# Altium project NFC-Reader.PrjPcb (part 6 of 11)
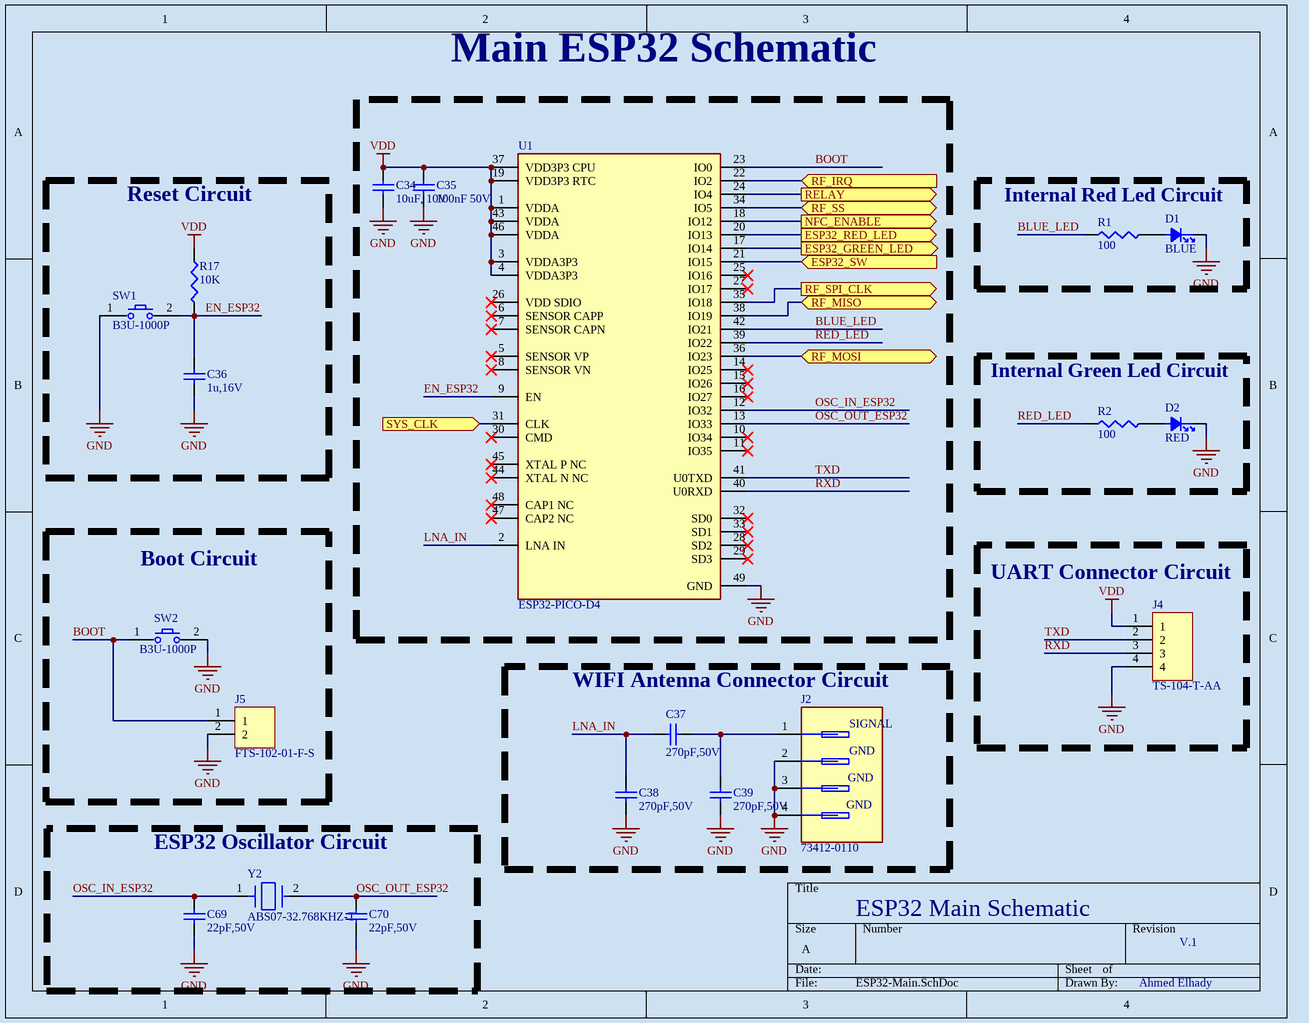
[diagram p9: ESP32-Main.SchDoc]

## Sheet ESP32-Main.SchDoc (continued)
### Library data of the parts
C34 = CL05A106MP8NUB8: 10 µF ±20% 10V Ceramic Capacitor X5R 0402 (1005 Metric); Manufacturer: Samsung Electro-Mechanics; Value: 10µF; Supplier: DigiKey; Manufacturer Part Number: CL05A106MP8NUB8; RoHS: Compliant; Category: Ceramic Capacitors; Pricing: 1=0.13, 10=0.077, 50=0.0678 (USD); Case/Package: 0402; Case Code (Imperial): 0402; Case Code (Metric): 1005; China RoHS: Compliant; Dielectric Material: Ceramic; Height: 800µm; Length: 1mm; Lifecycle Status: Production; Material: Ceramic; Max Operating Temperature: 85°C; Min Operating Temperature: -55°C; Mounting Technology: Surface Mount; Number of Terminals: 2; REACH SVHC: Yes; Schedule B: 8532240020, 8532240020|8532240020, 8532240020|8532240020|8532240020, 8532240020|8532240020|8532240020|8532240020; Thickness: 889µm; Tolerance: 20%; Voltage Rating: 10V; Voltage Rating (DC): 10V; Width: 500µm; ComponentLink1URL: https://datasheet.octopart.com:443/CL05A106MP8NUB8-Samsung-Electro-Mechanics-datasheet-136460857.pdf?src-supplier=IHS; ComponentLink1Description: https://datasheet.octopart.com:443/CL05A106MP8NUB8-Samsung-Electro-Mechanics-datasheet-136460857.pdf?src-supplier=IHS; ComponentLink2URL: https://datasheet.octopart.com:443/CL05A106MP8NUB8-Samsung-Electro-Mechanics-datasheet-181551178.pdf?src-supplier=Newark; ComponentLink2Description: https://datasheet.octopart.com:443/CL05A106MP8NUB8-Samsung-Electro-Mechanics-datasheet-181551178.pdf?src-supplier=Newark; ComponentLink3URL: https://datasheet.octopart.com:443/CL05A106MP8NUB8-Samsung-Electro-Mechanics-datasheet-136031724.pdf?src-supplier=Newark; ComponentLink3Description: https://datasheet.octopart.com:443/CL05A106MP8NUB8-Samsung-Electro-Mechanics-datasheet-136031724.pdf?src-supplier=Newark; ComponentLink4URL: https://datasheet.octopart.com:443/CL05A106MP8NUB8-Samsung-Electro-Mechanics-datasheet-141346815.pdf?src-supplier=Samsung+SCT; ComponentLink4Description: https://datasheet.octopart.com:443/CL05A106MP8NUB8-Samsung-Electro-Mechanics-datasheet-141346815.pdf?src-supplier=Samsung+SCT; ComponentLink5URL: https://datasheet.octopart.com:443/CL05A106MP8NUB8-Samsung-Electro-Mechanics-datasheet-110326781.pdf?src-supplier=Future+Electronics; ComponentLink5Description: https://datasheet.octopart.com:443/CL05A106MP8NUB8-Samsung-Electro-Mechanics-datasheet-110326781.pdf?src-supplier=Future+Electronics; ComponentLink6URL: https://datasheet.octopart.com:443/CL05A106MP8NUB8-Samsung-Electro-Mechanics-datasheet-96443587.pdf?src-supplier=Future+Electronics; ComponentLink6Description: https://datasheet.octopart.com:443/CL05A106MP8NUB8-Samsung-Electro-Mechanics-datasheet-96443587.pdf?src-supplier=Future+Electronics; ComponentLink7URL: https://datasheet.octopart.com:443/CL05A106MP8NUB8-Samsung-Electro-Mechanics-datasheet-68297032.pdf?src-supplier=Future+Electronics; ComponentLink7Description: https://datasheet.octopart.com:443/CL05A106MP8NUB8-Samsung-Electro-Mechanics-datasheet-68297032.pdf?src-supplier=Future+Electronics; ComponentLink8URL: https://datasheet.octopart.com:443/CL05A106MP8NUB8-Samsung-Electro-Mechanics-datasheet-86032222.pdf?src-supplier=Future+Electronics; ComponentLink8Description: https://datasheet.octopart.com:443/CL05A106MP8NUB8-Samsung-Electro-Mechanics-datasheet-86032222.pdf?src-supplier=Future+Electronics; LCSC Part Number: C307415
C35 = CGA3E2X7R1H104K080AA: 0.1 µF ±10% 50V Ceramic Capacitor X7R 0603 (1608 Metric); Manufacturer: TDK; Manufacturer Lifecycle Status: PRODUCTION; Supplier: DigiKey; Manufacturer Part Number: CGA3E2X7R1H104K080AA; RoHS: Compliant; Category: Ceramic Capacitors; Stock: 973492; Pricing: 1=0.1, 10=0.044, 50=0.0302, 100=0.026, 500=0.01886, 1000=0.01666 (USD); Value: 100nF; Case/Package: 0603; Case Code (Imperial): 0603; Case Code (Metric): 1608; China RoHS: Compliant; Composition: Ceramic; Depth: 800µm; Dielectric: X7R; Dielectric Material: Ceramic; Height: 800µm; Lead Free: Lead Free; Length: 1.6mm; Lifecycle Status: Production; Material: Ceramic; Max Length: 1.7mm; Max Operating Temperature: 125°C; Max Width: 900µm; Min Length: 1.5mm; Min Operating Temperature: -55°C; Min Width: 700µm; Mounting Technology: Surface Mount; Number of Terminals: 2; Radiation Hardening: No; Ratings: AEC-Q200; REACH SVHC: Yes; Schedule B: 8532240020, 8532240020|8532240020|8532240020|8532240020|8532240020; Termination: SMD/SMT; Thickness: 889µm; Tolerance: 10%; Voltage: 50V; Voltage Rating: 50V; Voltage Rating (DC): 50V; Weight: 2.012816mg; Width: 800µm; ComponentLink1URL: https://datasheet.octopart.com:443/CGA3E2X7R1H104K080AA-TDK-datasheet-165583812.pdf?src-supplier=IHS; ComponentLink1Description: https://datasheet.octopart.com:443/CGA3E2X7R1H104K080AA-TDK-datasheet-165583812.pdf?src-supplier=IHS; ComponentLink2URL: https://datasheet.octopart.com:443/CGA3E2X7R1H104K080AA-TDK-datasheet-138890726.pdf?src-supplier=Upverter; ComponentLink2Description: https://datasheet.octopart.com:443/CGA3E2X7R1H104K080AA-TDK-datasheet-138890726.pdf?src-supplier=Upverter; ComponentLink3URL: https://datasheet.octopart.com:443/CGA3E2X7R1H104K080AA-TDK-datasheet-43457115.pdf?src-supplier=Upverter; ComponentLink3Description: https://datasheet.octopart.com:443/CGA3E2X7R1H104K080AA-TDK-datasheet-43457115.pdf?src-supplier=Upverter; ComponentLink4URL: https://datasheet.octopart.com:443/CGA3E2X7R1H104K080AA-TDK-datasheet-151546526.pdf?src-supplier=ODG+(Origin+Data+Global); ComponentLink4Description: https://datasheet.octopart.com:443/CGA3E2X7R1H104K080AA-TDK-datasheet-151546526.pdf?src-supplier=ODG+(Origin+Data+Global); ComponentLink5URL: https://datasheet.octopart.com:443/CGA3E2X7R1H104K080AA-TDK-datasheet-43366117.pdf?src-supplier=Newark; ComponentLink5Description: https://datasheet.octopart.com:443/CGA3E2X7R1H104K080AA-TDK-datasheet-43366117.pdf?src-supplier=Newark; ComponentLink6URL: https://datasheet.octopart.com:443/CGA3E2X7R1H104K080AA-TDK-datasheet-23766614.pdf?src-supplier=Newark; ComponentLink6Description: https://datasheet.octopart.com:443/CGA3E2X7R1H104K080AA-TDK-datasheet-23766614.pdf?src-supplier=Newark; ComponentLink7URL: https://datasheet.octopart.com:443/CGA3E2X7R1H104K080AA-TDK-datasheet-13444418.pdf?src-supplier=Newark; ComponentLink7Description: https://datasheet.octopart.com:443/CGA3E2X7R1H104K080AA-TDK-datasheet-13444418.pdf?src-supplier=Newark; ComponentLink8URL: https://datasheet.octopart.com:443/CGA3E2X7R1H104K080AA.-TDK-datasheet-159510193.pdf?src-supplier=Newark; ComponentLink8Description: https://datasheet.octopart.com:443/CGA3E2X7R1H104K080AA.-TDK-datasheet-159510193.pdf?src-supplier=Newark; ComponentLink9URL: https://datasheet.octopart.com:443/CGA3E2X7R1H104K080AA-TDK-datasheet-136412745.pdf?src-supplier=element14+APAC; ComponentLink9Description: https://datasheet.octopart.com:443/CGA3E2X7R1H104K080AA-TDK-datasheet-136412745.pdf?src-supplier=element14+APAC; ComponentLink10URL: https://datasheet.octopart.com:443/CGA3E2X7R1H104K080AA-TDK-datasheet-21217900.pdf?src-supplier=Farnell; ComponentLink10Description: https://datasheet.octopart.com:443/CGA3E2X7R1H104K080AA-TDK-datasheet-21217900.pdf?src-supplier=Farnell; ComponentLink11URL: https://datasheet.octopart.com:443/CGA3E2X7R1H104K080AA-TDK-datasheet-164882302.pdf?src-supplier=Burklin+Elektronik; ComponentLink11Description: https://datasheet.octopart.com:443/CGA3E2X7R1H104K080AA-TDK-datasheet-164882302.pdf?src-supplier=Burklin+Elektronik; ComponentLink12URL: https://datasheet.octopart.com:443/CGA3E2X7R1H104K080AA-TDK-datasheet-13234200.pdf?src-supplier=Future+Electronics; ComponentLink12Description: https://datasheet.octopart.com:443/CGA3E2X7R1H104K080AA-TDK-datasheet-13234200.pdf?src-supplier=Future+Electronics; ComponentLink13URL: https://datasheet.octopart.com:443/CGA3E2X7R1H104K080AA-TDK-datasheet-12527010.pdf?src-supplier=Future+Electronics; ComponentLink13Description: https://datasheet.octopart.com:443/CGA3E2X7R1H104K080AA-TDK-datasheet-12527010.pdf?src-supplier=Future+Electronics; ComponentLink14URL: https://datasheet.octopart.com:443/CGA3E2X7R1H104K080AA-TDK-datasheet-140571036.pdf?src-supplier=Arrow.cn; ComponentLink14Description: https://datasheet.octopart.com:443/CGA3E2X7R1H104K080AA-TDK-datasheet-140571036.pdf?src-supplier=Arrow.cn; LCSC PN: C189228
C36 = EMK107B7105KA-T: 1 µF ±10% 16V Ceramic Capacitor X7R 0603 (1608 Metric); Manufacturer: Taiyo Yuden; Value: 1µF; Supplier: DigiKey; Manufacturer Part Number: EMK107B7105KA-T; RoHS: Compliant; Category: Ceramic Capacitors; Stock: 1003655; Pricing: 1=0.08, 10=0.013, 50=0.0116, 100=0.0104, 500=0.00964 (USD); Case/Package: 0603; Case Code (Imperial): 0603; Case Code (Metric): 1608; China RoHS: Compliant; Composition: Ceramic; Contact Plating: Nickel; Depth: 800µm; Dielectric: X7R; Dielectric Material: Ceramic; Halogen Free: Halogen Free; Height: 800µm; Lead Free: Lead Free; Length: 1.6mm; Lifecycle Status: Production; Material: Ceramic; Max Length: 1.7mm; Max Operating Temperature: 125°C; Max Thickness: 900µm; Max Width: 900µm; Min Length: 1.5mm; Min Operating Temperature: -55°C; Min Thickness: 700µm; Min Width: 700µm; Mounting Technology: Surface Mount; Pins: 2; Number of Terminals: 2; Packaging: Cut Tape; Radiation Hardening: No; REACH SVHC: Yes; Termination: SMD/SMT; Thickness: 889µm; Tolerance: 10%; Voltage Rating: 16V; Voltage Rating (DC): 16V; Width: 800µm; ComponentLink1URL: https://datasheet.octopart.com:443/EMK107B7105KA-T-Taiyo-Yuden-datasheet-182102775.pdf?src-supplier=IHS; ComponentLink1Description: https://datasheet.octopart.com:443/EMK107B7105KA-T-Taiyo-Yuden-datasheet-182102775.pdf?src-supplier=IHS; ComponentLink2URL: https://datasheet.octopart.com:443/EMK107B7105KA-T-Taiyo-Yuden-datasheet-8857305.pdf?src-supplier=Master+Electronics; ComponentLink2Description: https://datasheet.octopart.com:443/EMK107B7105KA-T-Taiyo-Yuden-datasheet-8857305.pdf?src-supplier=Master+Electronics; ComponentLink3URL: https://datasheet.octopart.com:443/EMK107B7105KA-T-Taiyo-Yuden-datasheet-154807686.pdf?src-supplier=Master+Electronics; ComponentLink3Description: https://datasheet.octopart.com:443/EMK107B7105KA-T-Taiyo-Yuden-datasheet-154807686.pdf?src-supplier=Master+Electronics; ComponentLink4URL: https://datasheet.octopart.com:443/EMK107B7105KA-T-Taiyo-Yuden-datasheet-140424376.pdf?src-supplier=Master+Electronics; ComponentLink4Description: https://datasheet.octopart.com:443/EMK107B7105KA-T-Taiyo-Yuden-datasheet-140424376.pdf?src-supplier=Master+Electronics; ComponentLink5URL: https://datasheet.octopart.com:443/EMK107B7105KA-T-Taiyo-Yuden-datasheet-151625811.pdf?src-supplier=Farnell; ComponentLink5Description: https://datasheet.octopart.com:443/EMK107B7105KA-T-Taiyo-Yuden-datasheet-151625811.pdf?src-supplier=Farnell; ComponentLink6URL: https://datasheet.octopart.com:443/EMK107B7105KA-T-Taiyo-Yuden-datasheet-65850851.pdf?src-supplier=Newark; ComponentLink6Description: https://datasheet.octopart.com:443/EMK107B7105KA-T-Taiyo-Yuden-datasheet-65850851.pdf?src-supplier=Newark; ComponentLink7URL: https://datasheet.octopart.com:443/EMK107B7105KA-T-Taiyo-Yuden-datasheet-14717454.pdf?src-supplier=Newark; ComponentLink7Description: https://datasheet.octopart.com:443/EMK107B7105KA-T-Taiyo-Yuden-datasheet-14717454.pdf?src-supplier=Newark; ComponentLink8URL: https://datasheet.octopart.com:443/EMK107B7105KA-T-Taiyo-Yuden-datasheet-138738940.pdf?src-supplier=Taiyo+Yuden+SCT; ComponentLink8Description: https://datasheet.octopart.com:443/EMK107B7105KA-T-Taiyo-Yuden-datasheet-138738940.pdf?src-supplier=Taiyo+Yuden+SCT; ComponentLink9URL: https://datasheet.octopart.com:443/EMK107B7105KA-T-Taiyo-Yuden-datasheet-99784766.pdf?src-supplier=Future+Electronics; ComponentLink9Description: https://datasheet.octopart.com:443/EMK107B7105KA-T-Taiyo-Yuden-datasheet-99784766.pdf?src-supplier=Future+Electronics; ComponentLink10URL: https://datasheet.octopart.com:443/EMK107B7105KA-T-Taiyo-Yuden-datasheet-99833418.pdf?src-supplier=Future+Electronics; ComponentLink10Description: https://datasheet.octopart.com:443/EMK107B7105KA-T-Taiyo-Yuden-datasheet-99833418.pdf?src-supplier=Future+Electronics; ComponentLink11URL: https://datasheet.octopart.com:443/CEEMK107B7105KA-T-Taiyo-Yuden-datasheet-62282700.pdf?src-supplier=Electro+Sonic; ComponentLink11Description: https://datasheet.octopart.com:443/CEEMK107B7105KA-T-Taiyo-Yuden-datasheet-62282700.pdf?src-supplier=Electro+Sonic; ComponentLink12URL: https://datasheet.octopart.com:443/EMK107B7105KA-T-Taiyo-Yuden-datasheet-62109223.pdf?src-supplier=Electro+Sonic; ComponentLink12Description: https://datasheet.octopart.com:443/EMK107B7105KA-T-Taiyo-Yuden-datasheet-62109223.pdf?src-supplier=Electro+Sonic; ComponentLink13URL: https://datasheet.octopart.com:443/EMK107B7105KA-T-Taiyo-Yuden-datasheet-41181424.pdf?src-supplier=Electro+Sonic; ComponentLink13Description: https://datasheet.octopart.com:443/EMK107B7105KA-T-Taiyo-Yuden-datasheet-41181424.pdf?src-supplier=Electro+Sonic; ComponentLink14URL: https://datasheet.octopart.com/EMK107B7105KA-T-Taiyo-Yuden-datasheet-17272276.pdf; ComponentLink14Description: https://datasheet.octopart.com/EMK107B7105KA-T-Taiyo-Yuden-datasheet-17272276.pdf; ComponentLink15URL: https://datasheet.octopart.com:443/EMK107B7105KA-T-Taiyo-Yuden-datasheet-13693549.pdf?src-supplier=_legacy+Avnet; ComponentLink15Description: https://datasheet.octopart.com:443/EMK107B7105KA-T-Taiyo-Yuden-datasheet-13693549.pdf?src-supplier=_legacy+Avnet; ComponentLink16URL: https://datasheet.octopart.com:443/EMK107B7105KA-T-Taiyo-Yuden-datasheet-10851928.pdf?src-supplier=element14; ComponentLink16Description: https://datasheet.octopart.com:443/EMK107B7105KA-T-Taiyo-Yuden-datasheet-10851928.pdf?src-supplier=element14; ComponentLink17URL: https://datasheet.octopart.com:443/EMK107B7105KA-T-Taiyo-Yuden-datasheet-8434558.pdf?src-supplier=element14; ComponentLink17Description: https://datasheet.octopart.com:443/EMK107B7105KA-T-Taiyo-Yuden-datasheet-8434558.pdf?src-supplier=element14; ComponentLink18URL: https://datasheet.octopart.com:443/EMK107B7105KA-T-Taiyo-Yuden-datasheet-10742123.pdf?src-supplier=Factory+Futures; ComponentLink18Description: https://datasheet.octopart.com:443/EMK107B7105KA-T-Taiyo-Yuden-datasheet-10742123.pdf?src-supplier=Factory+Futures; LCSC PN: C92759
C37-C39 = GCM1555C1H271JA16D: 270 pF ±5% 50V Ceramic Capacitor C0G, NP0 0402 (1005 Metric); Manufacturer: Murata; Manufacturer Lifecycle Status: IN PRODUCTION; Temperature Coefficient: 30ppm/°C; Supplier: DigiKey; Manufacturer Part Number: GCM1555C1H271JA16D; RoHS: Compliant; Category: Ceramic Capacitors; Stock: 38477; Pricing: 1=0.1, 10=0.039, 50=0.0262, 100=0.0224, 500=0.0161, 1000=0.01417, 2500=0.01216, 5000=0.01091, 10000=0.00866, 20000=0.00857, 30000=0.00852, 50000=0.00843, 70000=0.00816, 100000=0.0079, 120000=0.00778, 240000=0.00768 (USD); Value: 270pF; Case/Package: 0402; Case Code (Imperial): 0402; Case Code (Metric): 1005; Depth: 500µm; Dielectric: C0G; Dielectric Material: Ceramic; Height: 500µm; Length: 1mm; Lifecycle Status: Production; Material: Ceramic; Max Operating Temperature: 125°C; Min Operating Temperature: -55°C; Mounting Technology: Surface Mount; Number of Terminals: 2; Packaging: Tape & Reel; Radiation Hardening: No; Ratings: AEC-Q200; REACH SVHC: Yes; Schedule B: 8532240020, 8532240020|8532240020, 8532240020|8532240020|8532240020, 8532240020|8532240020|8532240020|8532240020; Termination: SMD/SMT; Tolerance: 5%; Voltage Rating: 50V; Voltage Rating (DC): 50V; Width: 500µm; ComponentLink1URL: https://datasheet.octopart.com:443/GCM1555C1H271JA16D-Murata-datasheet-149522333.pdf?src-supplier=Newark; ComponentLink1Description: https://datasheet.octopart.com:443/GCM1555C1H271JA16D-Murata-datasheet-149522333.pdf?src-supplier=Newark; ComponentLink2URL: https://datasheet.octopart.com:443/GCM1555C1H271JA16D-Murata-datasheet-141265891.pdf?src-supplier=Geoflip; ComponentLink2Description: https://datasheet.octopart.com:443/GCM1555C1H271JA16D-Murata-datasheet-141265891.pdf?src-supplier=Geoflip; ComponentLink3URL: https://datasheet.octopart.com:443/GCM1555C1H271JA16D-Murata-datasheet-178527090.pdf?src-supplier=Arrow.cn; ComponentLink3Description: https://datasheet.octopart.com:443/GCM1555C1H271JA16D-Murata-datasheet-178527090.pdf?src-supplier=Arrow.cn; ComponentLink4URL: https://datasheet.octopart.com:443/GCM1555C1H271JA16D-Murata-datasheet-140656005.pdf?src-supplier=Ciiva; ComponentLink4Description: https://datasheet.octopart.com:443/GCM1555C1H271JA16D-Murata-datasheet-140656005.pdf?src-supplier=Ciiva; ComponentLink5URL: https://datasheet.octopart.com:443/GCM1555C1H271JA16D-Murata-datasheet-138715700.pdf?src-supplier=Ciiva; ComponentLink5Description: https://datasheet.octopart.com:443/GCM1555C1H271JA16D-Murata-datasheet-138715700.pdf?src-supplier=Ciiva; ComponentLink6URL: https://datasheet.octopart.com:443/GCM1555C1H271JA16D-Murata-datasheet-128592787.pdf?src-supplier=X-ON; ComponentLink6Description: https://datasheet.octopart.com:443/GCM1555C1H271JA16D-Murata-datasheet-128592787.pdf?src-supplier=X-ON; ComponentLink7URL: https://datasheet.octopart.com:443/GCM1555C1H271JA16D-Murata-datasheet-11767037.pdf?src-supplier=Arrow+Electronics; ComponentLink7Description: https://datasheet.octopart.com:443/GCM1555C1H271JA16D-Murata-datasheet-11767037.pdf?src-supplier=Arrow+Electronics; ComponentLink8URL: https://datasheet.octopart.com:443/GCM1555C1H271JA16D-Murata-datasheet-12511495.pdf?src-supplier=TME; ComponentLink8Description: https://datasheet.octopart.com:443/GCM1555C1H271JA16D-Murata-datasheet-12511495.pdf?src-supplier=TME; ComponentLink9URL: https://datasheet.octopart.com/GCM1555C1H271JA16D-Murata-datasheet-14404338.pdf; ComponentLink9Description: https://datasheet.octopart.com/GCM1555C1H271JA16D-Murata-datasheet-14404338.pdf; ComponentLink10URL: http://sigma.octopart.com:80/reach_statement/Murata-company-16.pdf?src-supplier=Compliance+Statements; ComponentLink10Description: http://sigma.octopart.com:80/reach_statement/Murata-company-16.pdf?src-supplier=Compliance+Statements; LCSC PN: C524551
C69 C70 = C0603C220J5GACTU: 22 pF ±5% 50V Ceramic Capacitor C0G, NP0 0603 (1608 Metric); Manufacturer: KEMET; Temperature Coefficient: 30ppm/°C; Supplier: DigiKey; Manufacturer Part Number: C0603C220J5GACTU; RoHS: Compliant; Category: Ceramic Capacitors; Stock: 154784; Pricing: 1=0.12, 10=0.069, 50=0.0476, 100=0.0413, 500=0.03068, 1000=0.0274, 4000=0.02251, 8000=0.01825, 12000=0.01762, 20000=0.0175, 28000=0.01691, 40000=0.01684, 48000=0.0168, 96000=0.01646, 100000=0.01642 (USD); Value: 22pF; Case/Package: 0603; Case Code (Imperial): 0603; China RoHS: Compliant; Contact Material: Tin; Depth: 800µm; Dielectric: C0G; Dielectric Material: Ceramic; Height: 800µm; Lead Free: Lead Free; Length: 1.6mm; Lifecycle Status: Production; Material: Ceramic; Max Operating Temperature: 125°C; Min Operating Temperature: -55°C; Mounting Technology: Surface Mount; Pins: 2; Number of Terminals: 2; Radiation Hardening: No; REACH SVHC: Yes; Schedule B: 8532240020, 8532240020|8532240020, 8532240020|8532240020|8532240020, 8532240020|8532240020|8532240020|8532240020; Termination: SMD/SMT; Thickness: 863.6µm; Tolerance: 5%; Voltage: 50V; Voltage Rating: 50V; Voltage Rating (DC): 50V; Weight: 2.012816mg; Width: 800µm; ComponentLink1URL: https://datasheet.octopart.com:443/C0603C220J5GACTU-KEMET-datasheet-178132257.pdf?src-supplier=IHS; ComponentLink1Description: https://datasheet.octopart.com:443/C0603C220J5GACTU-KEMET-datasheet-178132257.pdf?src-supplier=IHS; ComponentLink2URL: https://datasheet.octopart.com:443/C0603C220J5GAC7867-KEMET-datasheet-184792853.pdf?src-supplier=IHS; ComponentLink2Description: https://datasheet.octopart.com:443/C0603C220J5GAC7867-KEMET-datasheet-184792853.pdf?src-supplier=IHS; ComponentLink3URL: https://datasheet.octopart.com:443/C0603C220J5GACTU-KEMET-datasheet-68331921.pdf?src-supplier=Upverter; ComponentLink3Description: https://datasheet.octopart.com:443/C0603C220J5GACTU-KEMET-datasheet-68331921.pdf?src-supplier=Upverter; ComponentLink4URL: https://datasheet.octopart.com:443/C0603C220J5GACTU-KEMET-datasheet-137357764.pdf?src-supplier=Upverter; ComponentLink4Description: https://datasheet.octopart.com:443/C0603C220J5GACTU-KEMET-datasheet-137357764.pdf?src-supplier=Upverter; ComponentLink5URL: https://datasheet.octopart.com:443/C0603C220J5GACTU-Kemet-datasheet-5314449.pdf?src-supplier=Newark; ComponentLink5Description: https://datasheet.octopart.com:443/C0603C220J5GACTU-Kemet-datasheet-5314449.pdf?src-supplier=Newark; ComponentLink6URL: https://datasheet.octopart.com:443/C0603C220J5GACTU-Kemet-datasheet-10282724.pdf?src-supplier=Newark; ComponentLink6Description: https://datasheet.octopart.com:443/C0603C220J5GACTU-Kemet-datasheet-10282724.pdf?src-supplier=Newark; ComponentLink7URL: https://datasheet.octopart.com:443/C0603C220J5GACTU-KEMET-datasheet-176142189.pdf?src-supplier=Newark; ComponentLink7Description: https://datasheet.octopart.com:443/C0603C220J5GACTU-KEMET-datasheet-176142189.pdf?src-supplier=Newark; ComponentLink8URL: https://datasheet.octopart.com:443/C0603C220J5GACTU-KEMET-datasheet-149521956.pdf?src-supplier=Farnell; ComponentLink8Description: https://datasheet.octopart.com:443/C0603C220J5GACTU-KEMET-datasheet-149521956.pdf?src-supplier=Farnell; ComponentLink9URL: https://datasheet.octopart.com:443/C0603C220J5GACTU-KEMET-datasheet-101575729.pdf?src-supplier=Farnell; ComponentLink9Description: https://datasheet.octopart.com:443/C0603C220J5GACTU-KEMET-datasheet-101575729.pdf?src-supplier=Farnell; ComponentLink10URL: https://datasheet.octopart.com:443/C0603C220J5GACTU-Kemet-datasheet-10540709.pdf?src-supplier=Farnell; ComponentLink10Description: https://datasheet.octopart.com:443/C0603C220J5GACTU-Kemet-datasheet-10540709.pdf?src-supplier=Farnell; ComponentLink11URL: https://datasheet.octopart.com:443/C0603C220J5GACTU-KEMET-datasheet-176142187.pdf?src-supplier=element14+APAC; ComponentLink11Description: https://datasheet.octopart.com:443/C0603C220J5GACTU-KEMET-datasheet-176142187.pdf?src-supplier=element14+APAC; ComponentLink12URL: https://datasheet.octopart.com:443/C0603C220J5GACTU-KEMET-datasheet-176142144.pdf?src-supplier=element14+APAC; ComponentLink12Description: https://datasheet.octopart.com:443/C0603C220J5GACTU-KEMET-datasheet-176142144.pdf?src-supplier=element14+APAC; ComponentLink13URL: https://datasheet.octopart.com:443/C0603C220J5GACTU-Kemet-datasheet-22084244.pdf?src-supplier=element14+APAC; ComponentLink13Description: https://datasheet.octopart.com:443/C0603C220J5GACTU-Kemet-datasheet-22084244.pdf?src-supplier=element14+APAC; ComponentLink14URL: https://datasheet.octopart.com:443/C0603C220J5GACTU-Kemet-datasheet-48952580.pdf?src-supplier=element14+APAC; ComponentLink14Description: https://datasheet.octopart.com:443/C0603C220J5GACTU-Kemet-datasheet-48952580.pdf?src-supplier=element14+APAC; ComponentLink15URL: https://datasheet.octopart.com:443/C0603C220J5GACTU-KEMET-datasheet-157246123.pdf?src-supplier=Electro+Sonic; ComponentLink15Description: https://datasheet.octopart.com:443/C0603C220J5GACTU-KEMET-datasheet-157246123.pdf?src-supplier=Electro+Sonic; ComponentLink16URL: https://datasheet.octopart.com:443/C0603C220J5GACTU-KEMET-datasheet-41232428.pdf?src-supplier=Electro+Sonic; ComponentLink16Description: https://datasheet.octopart.com:443/C0603C220J5GACTU-KEMET-datasheet-41232428.pdf?src-supplier=Electro+Sonic; ComponentLink17URL: https://datasheet.octopart.com:443/C0603C220J5GACTU-KEMET-datasheet-96931677.pdf?src-supplier=TME; ComponentLink17Description: https://datasheet.octopart.com:443/C0603C220J5GACTU-KEMET-datasheet-96931677.pdf?src-supplier=TME; ComponentLink18URL: https://datasheet.octopart.com/C0603C220J5GACTU-KEMET-datasheet-84169754.pdf; ComponentLink18Description: https://datasheet.octopart.com/C0603C220J5GACTU-KEMET-datasheet-84169754.pdf; ComponentLink19URL: https://datasheet.octopart.com:443/C0603C220J5GAC7867-KEMET-datasheet-164857143.pdf?src-supplier=Burklin+Elektronik; ComponentLink19Description: https://datasheet.octopart.com:443/C0603C220J5GAC7867-KEMET-datasheet-164857143.pdf?src-supplier=Burklin+Elektronik; ComponentLink20URL: https://datasheet.octopart.com:443/C0603C220J5GAC-TU-Kemet-datasheet-7278821.pdf?src-supplier=Jameco; ComponentLink20Description: https://datasheet.octopart.com:443/C0603C220J5GAC-TU-Kemet-datasheet-7278821.pdf?src-supplier=Jameco; ComponentLink21URL: https://datasheet.octopart.com:443/C0603C220J5GACTU-Kemet-datasheet-464.pdf?src-supplier=RS+(Formerly+Allied+Electronics); ComponentLink21Description: https://datasheet.octopart.com:443/C0603C220J5GACTU-Kemet-datasheet-464.pdf?src-supplier=RS+(Formerly+Allied+Electronics); LCSC PN: C2167297
D1 = VLMB1500-GS08: Blue 472nm LED Indication - Discrete 2.8V 0402 (1005 Metric); Manufacturer: Vishay; Dominant Wavelength: 470nm; Forward Current: 20mA; Forward Voltage: 3.15V; Lens Color: Clear; Lens Style: Rectangular; Luminous Intensity: 11.2mcd; Max Power Dissipation: 76mW; Number of Circuits: 1; Peak Wavelength: 468nm; Power Rating: 75mW; Reverse Voltage: 5V; Test Current: 5mA; Viewing Angle: 130°; Supplier: DigiKey; Manufacturer Part Number: VLMB1500-GS08; RoHS: Compliant; Category: LEDs; Stock: 220164; Pricing: 1=0.27, 10=0.184, 100=0.1293, 500=0.10424, 1000=0.09596 (USD); Ambient Temperature Range High: 80°C; Case/Package: 0402; Case Code (Imperial): 0402; Case Code (Metric): 1005; Color: Blue; Contact Plating: Tin; Depth: 500µm; Height: 350µm; Illumination Color: Blue; Lead Free: Lead Free; Length: 1mm; Lifecycle Status: Production; Max Operating Temperature: 80°C; Min Operating Temperature: -30°C; Mounting Technology: Surface Mount; Number of Elements: 1; Number of LEDs: 1; Pins: 2; Number of Terminals: 2; Packaging: Cut Tape; Power Dissipation: 76mW; Radiation Hardening: No; REACH SVHC: Yes; Schedule B: 8541402000, 8541402000|8541402000|8541402000|8541402000|8541402000; Shape: Rectangular; Terminal Pitch: 675µm; Wavelength: 472nm; Width: 500µm; ComponentLink1URL: https://datasheet.octopart.com:443/VLMB1500-GS08-Vishay-datasheet-181477802.pdf?src-supplier=IHS; ComponentLink1Description: https://datasheet.octopart.com:443/VLMB1500-GS08-Vishay-datasheet-181477802.pdf?src-supplier=IHS; ComponentLink2URL: https://datasheet.octopart.com:443/VLMB1500-GS08-Vishay-datasheet-21227148.pdf?src-supplier=element14+APAC; ComponentLink2Description: https://datasheet.octopart.com:443/VLMB1500-GS08-Vishay-datasheet-21227148.pdf?src-supplier=element14+APAC; ComponentLink3URL: https://datasheet.octopart.com:443/VLMB1500-GS08-Vishay-datasheet-78835484.pdf?src-supplier=element14+APAC; ComponentLink3Description: https://datasheet.octopart.com:443/VLMB1500-GS08-Vishay-datasheet-78835484.pdf?src-supplier=element14+APAC; ComponentLink4URL: https://datasheet.octopart.com:443/VLMB1500-GS08-Vishay-datasheet-33014519.pdf?src-supplier=element14+APAC; ComponentLink4Description: https://datasheet.octopart.com:443/VLMB1500-GS08-Vishay-datasheet-33014519.pdf?src-supplier=element14+APAC; ComponentLink5URL: https://datasheet.octopart.com:443/VLMB1500-GS08-Vishay-datasheet-102762782.pdf?src-supplier=Upverter; ComponentLink5Description: https://datasheet.octopart.com:443/VLMB1500-GS08-Vishay-datasheet-102762782.pdf?src-supplier=Upverter; ComponentLink6URL: https://datasheet.octopart.com:443/VLMB1500-GS08-Vishay-datasheet-82289476.pdf?src-supplier=TME; ComponentLink6Description: https://datasheet.octopart.com:443/VLMB1500-GS08-Vishay-datasheet-82289476.pdf?src-supplier=TME; ComponentLink7URL: https://datasheet.octopart.com:443/VLMB1500-GS08-Vishay-datasheet-62332426.pdf?src-supplier=Newark; ComponentLink7Description: https://datasheet.octopart.com:443/VLMB1500-GS08-Vishay-datasheet-62332426.pdf?src-supplier=Newark; ComponentLink8URL: http://sigma.octopart.com:80/rohs_statement/Vishay-company-15.pdf?src-supplier=Compliance+Statements; ComponentLink8Description: http://sigma.octopart.com:80/rohs_statement/Vishay-company-15.pdf?src-supplier=Compliance+Statements; LCSC PN: C511042
D2 = VLMS1500-GS08: Red 631nm LED Indication - Discrete 2V 0402 (1005 Metric); Manufacturer: Vishay; Forward Current: 30mA; Forward Voltage: 2.4V; Lens Style: Rectangular, Square; Luminous Intensity: 18mcd; Number of Circuits: 1; Power Rating: 75mW; Reverse Voltage: 5V; Shape: Rectangular; Test Current: 20mA; Viewing Angle: 130°; Supplier: DigiKey; Manufacturer Part Number: VLMS1500-GS08; RoHS: Compliant; Category: LEDs; Pricing: 1=0.24, 10=0.164, 100=0.1147, 500=0.09218, 1000=0.0847 (USD); Case/Package: 0402; Case Code (Imperial): 0402; Case Code (Metric): 1005; Color: Red; Dominant Wavelength: 631nm; Height: 350µm; Illumination Color: Red; Lead Free: Lead Free; Length: 1mm; Lifecycle Status: Production; Max Operating Temperature: 85°C; Min Operating Temperature: -30°C; Mounting Technology: Surface Mount; Number of LEDs: 1; Pins: 2; Number of Terminals: 2; Packaging: Cut Tape; Peak Wavelength: 631nm; Radiation Hardening: No; REACH SVHC: Yes; Schedule B: 8541402000, 8541402000|8541402000|8541402000|8541402000|8541402000; Terminal Pitch: 675µm; Wavelength: 631nm; Width: 500µm; ComponentLink1URL: https://datasheet.octopart.com:443/VLMS1500-GS08-Vishay-datasheet-181477802.pdf?src-supplier=IHS; ComponentLink1Description: https://datasheet.octopart.com:443/VLMS1500-GS08-Vishay-datasheet-181477802.pdf?src-supplier=IHS; ComponentLink2URL: https://datasheet.octopart.com:443/VLMS1500-GS08-Vishay-datasheet-21227148.pdf?src-supplier=Future+Electronics; ComponentLink2Description: https://datasheet.octopart.com:443/VLMS1500-GS08-Vishay-datasheet-21227148.pdf?src-supplier=Future+Electronics; ComponentLink3URL: https://datasheet.octopart.com:443/VLMS1500-GS08-Vishay-datasheet-102762782.pdf?src-supplier=Future+Electronics; ComponentLink3Description: https://datasheet.octopart.com:443/VLMS1500-GS08-Vishay-datasheet-102762782.pdf?src-supplier=Future+Electronics; ComponentLink4URL: https://datasheet.octopart.com:443/VLMS1500-GS08-Vishay-datasheet-33014519.pdf?src-supplier=element14+APAC; ComponentLink4Description: https://datasheet.octopart.com:443/VLMS1500-GS08-Vishay-datasheet-33014519.pdf?src-supplier=element14+APAC; ComponentLink5URL: https://datasheet.octopart.com:443/VLMS1500-GS08-Vishay-datasheet-68326145.pdf?src-supplier=TME; ComponentLink5Description: https://datasheet.octopart.com:443/VLMS1500-GS08-Vishay-datasheet-68326145.pdf?src-supplier=TME; ComponentLink6URL: https://datasheet.octopart.com:443/VLMS1500-GS08-Vishay-Siliconix-datasheet-62309867.pdf?src-supplier=RS+(Formerly+Allied+Electronics); ComponentLink6Description: https://datasheet.octopart.com:443/VLMS1500-GS08-Vishay-Siliconix-datasheet-62309867.pdf?src-supplier=RS+(Formerly+Allied+Electronics); ComponentLink7URL: https://datasheet.octopart.com:443/VLMS1500-GS08-Vishay-datasheet-62332426.pdf?src-supplier=Newark; ComponentLink7Description: https://datasheet.octopart.com:443/VLMS1500-GS08-Vishay-datasheet-62332426.pdf?src-supplier=Newark; ComponentLink8URL: https://datasheet.octopart.com/VLMS1500-GS08-Vishay-datasheet-16093911.pdf; ComponentLink8Description: https://datasheet.octopart.com/VLMS1500-GS08-Vishay-datasheet-16093911.pdf; ComponentLink9URL: http://sigma.octopart.com:80/rohs_statement/Vishay-company-15.pdf?src-supplier=Compliance+Statements; ComponentLink9Description: http://sigma.octopart.com:80/rohs_statement/Vishay-company-15.pdf?src-supplier=Compliance+Statements; LCSC Part Number: C511370
J2 = 73412-0110: U.FL (UMCC) ANTENNA Connector Receptacle, Male Pin 50 Ohms Surface Mount Solder; Manufacturer: Molex; Manufacturer Lifecycle Status: ACTIVE; Body Material: Liquid Crystal Polymer, Polymer; Body Plating: Gold; Connector Type: Coaxial; Contact Resistance: 25mΩ; Dielectric Material: Liquid Crystal Polymer; Frequency: 6GHz; Gender: Female; Impedance: 50Ω; Insulation Resistance: 100MΩ; Number of Ports: 1; Polarity: Standard; Voltage Rating: 60V; Supplier: DigiKey; Manufacturer Part Number: 73412-0110; RoHS: Compliant; Category: RF / Coaxial Connectors; Stock: 130802; Pricing: 1=0.8, 10=0.675, 25=0.6328, 50=0.6028, 100=0.5739, 250=0.53788, 500=0.5122, 1000=0.48774, 2500=0.4572, 5000=0.42867, 10000=0.40822, 15000=0.39672, 25000=0.38269 (USD); China RoHS: Compliant; Contact Gender: Female; Contact Material: Brass; Contact Plating: Gold; Country of Origin: US; Halogen Free: Low Halogen; Height: 1.25mm; Lead Free: Lead Free; Length: 3mm; Lifecycle Status: Production; Material: Bronze; Clock Frequency: 6GHz; Max Operating Temperature: 90°C; Min Operating Temperature: -40°C; Mounting Technology: Surface Mount; Pins: 1; Orientation: Straight; Packaging: Tape and Reel; Radiation Hardening: No; REACH SVHC: Yes; Termination: Solder; Voltage Rating (AC): 60V; Width: 3mm; ComponentLink1URL: https://datasheet.octopart.com:443/73412-0110-Molex-datasheet-180780342.pdf?src-supplier=IHS; ComponentLink1Description: https://datasheet.octopart.com:443/73412-0110-Molex-datasheet-180780342.pdf?src-supplier=IHS; ComponentLink2URL: https://datasheet.octopart.com:443/73412-0110-Molex-datasheet-13797444.pdf?src-supplier=Molex; ComponentLink2Description: https://datasheet.octopart.com:443/73412-0110-Molex-datasheet-13797444.pdf?src-supplier=Molex; ComponentLink3URL: https://datasheet.octopart.com:443/73412-0110-Molex-datasheet-12565081.pdf?src-supplier=Upverter; ComponentLink3Description: https://datasheet.octopart.com:443/73412-0110-Molex-datasheet-12565081.pdf?src-supplier=Upverter; ComponentLink4URL: https://datasheet.octopart.com:443/73412-0110-Molex-datasheet-8545995.pdf?src-supplier=Upverter; ComponentLink4Description: https://datasheet.octopart.com:443/73412-0110-Molex-datasheet-8545995.pdf?src-supplier=Upverter; ComponentLink5URL: https://datasheet.octopart.com:443/73412-0110-Molex-datasheet-154758340.pdf?src-supplier=Master+Electronics; ComponentLink5Description: https://datasheet.octopart.com:443/73412-0110-Molex-datasheet-154758340.pdf?src-supplier=Master+Electronics; ComponentLink6URL: https://datasheet.octopart.com:443/73412-0110-Molex-datasheet-101583680.pdf?src-supplier=Farnell; ComponentLink6Description: https://datasheet.octopart.com:443/73412-0110-Molex-datasheet-101583680.pdf?src-supplier=Farnell; ComponentLink7URL: https://datasheet.octopart.com:443/73412-0110-Molex-datasheet-11536961.pdf?src-supplier=Farnell; ComponentLink7Description: https://datasheet.octopart.com:443/73412-0110-Molex-datasheet-11536961.pdf?src-supplier=Farnell; ComponentLink8URL: https://datasheet.octopart.com:443/73412-0110-Molex-datasheet-11046821.pdf?src-supplier=Farnell; ComponentLink8Description: https://datasheet.octopart.com:443/73412-0110-Molex-datasheet-11046821.pdf?src-supplier=Farnell; ComponentLink9URL: https://datasheet.octopart.com:443/73412-0110-Molex-datasheet-540048.pdf?src-supplier=Farnell; ComponentLink9Description: https://datasheet.octopart.com:443/73412-0110-Molex-datasheet-540048.pdf?src-supplier=Farnell; ComponentLink10URL: https://datasheet.octopart.com:443/73412-0110-Molex-datasheet-27085815.pdf?src-supplier=Electro+Sonic; ComponentLink10Description: https://datasheet.octopart.com:443/73412-0110-Molex-datasheet-27085815.pdf?src-supplier=Electro+Sonic; ComponentLink11URL: https://datasheet.octopart.com:443/73412-0110-Molex-datasheet-44403139.pdf?src-supplier=Electro+Sonic; ComponentLink11Description: https://datasheet.octopart.com:443/73412-0110-Molex-datasheet-44403139.pdf?src-supplier=Electro+Sonic; ComponentLink12URL: https://datasheet.octopart.com:443/73412-0110-Molex-datasheet-188909867.pdf?src-supplier=TME; ComponentLink12Description: https://datasheet.octopart.com:443/73412-0110-Molex-datasheet-188909867.pdf?src-supplier=TME; ComponentLink13URL: https://datasheet.octopart.com:443/73412-0110-Molex-datasheet-45012700.pdf?src-supplier=TME; ComponentLink13Description: https://datasheet.octopart.com:443/73412-0110-Molex-datasheet-45012700.pdf?src-supplier=TME; ComponentLink14URL: https://datasheet.octopart.com:443/73412-0110-Molex-datasheet-140187864.pdf?src-supplier=RS+(Formerly+Allied+Electronics); ComponentLink14Description: https://datasheet.octopart.com:443/73412-0110-Molex-datasheet-140187864.pdf?src-supplier=RS+(Formerly+Allied+Electronics); ComponentLink15URL: https://datasheet.octopart.com:443/73412-0110-Molex-datasheet-120156196.pdf?src-supplier=RS+(Formerly+Allied+Electronics); ComponentLink15Description: https://datasheet.octopart.com:443/73412-0110-Molex-datasheet-120156196.pdf?src-supplier=RS+(Formerly+Allied+Electronics); ComponentLink16URL: https://datasheet.octopart.com:443/73412-0110-Molex-datasheet-34442373.pdf?src-supplier=RS+(Formerly+Allied+Electronics); ComponentLink16Description: https://datasheet.octopart.com:443/73412-0110-Molex-datasheet-34442373.pdf?src-supplier=RS+(Formerly+Allied+Electronics); ComponentLink17URL: https://datasheet.octopart.com:443/734120110-Molex-datasheet-137316104.pdf?src-supplier=Future+Electronics; ComponentLink17Description: https://datasheet.octopart.com:443/734120110-Molex-datasheet-137316104.pdf?src-supplier=Future+Electronics; ComponentLink18URL: https://datasheet.octopart.com:443/73412-0110-Molex-datasheet-33004214.pdf?src-supplier=Newark; ComponentLink18Description: https://datasheet.octopart.com:443/73412-0110-Molex-datasheet-33004214.pdf?src-supplier=Newark; ComponentLink19URL: https://datasheet.octopart.com:443/73412-0110-Molex-datasheet-33004213.pdf?src-supplier=Newark; ComponentLink19Description: https://datasheet.octopart.com:443/73412-0110-Molex-datasheet-33004213.pdf?src-supplier=Newark; ComponentLink20URL: http://sigma.octopart.com:80/16441449/rohs_statement/Molex-734120110.pdf?src-supplier=Compliance+Statements; ComponentLink20Description: http://sigma.octopart.com:80/16441449/rohs_statement/Molex-734120110.pdf?src-supplier=Compliance+Statements; ComponentLink21URL: http://sigma.octopart.com:80/conflict_mineral_statement/Molex-company-72.pdf?src-supplier=Compliance+Statements; ComponentLink21Description: http://sigma.octopart.com:80/conflict_mineral_statement/Molex-company-72.pdf?src-supplier=Compliance+Statements; ComponentLink22URL: http://sigma.octopart.com:80/rohs_statement/Molex-company-73.pdf?src-supplier=Compliance+Statements; ComponentLink22Description: http://sigma.octopart.com:80/rohs_statement/Molex-company-73.pdf?src-supplier=Compliance+Statements; ComponentLink23URL: http://sigma.octopart.com:80/reach_statement/Molex-company-74.pdf?src-supplier=Compliance+Statements; ComponentLink23Description: http://sigma.octopart.com:80/reach_statement/Molex-company-74.pdf?src-supplier=Compliance+Statements; LCSC PN: C434806
J4 = TS-104-T-AA: 4 Position Header Connector Post Tin; Manufacturer: Samtec; Manufacturer Lifecycle Status: PRODUCTION; Gender: Male; Max Current Rating: 1A; Number of Contacts: 4; Pitch: 2.54mm; Supplier: DigiKey; Manufacturer Part Number: TS-104-T-AA; RoHS: Compliant; Category: Headers and Wire Housings; Stock: 916; Pricing: 1=0.73, 50=0.57, 100=0.46, 500=0.39, 1000=0.372 (USD); Contact Material: Brass; Contact Plating: Tin; Lifecycle Status: Production; Max Operating Temperature: 105°C; Min Operating Temperature: -55°C; Mounting Technology: Through Hole; Number of Rows: 1; Orientation: Straight; Radiation Hardening: No; REACH SVHC: No; Termination: Solder; ComponentLink1URL: https://datasheet.octopart.com:443/TS-104-T-AA-Samtec-datasheet-97318998.pdf?src-supplier=Master+Electronics; ComponentLink1Description: https://datasheet.octopart.com:443/TS-104-T-AA-Samtec-datasheet-97318998.pdf?src-supplier=Master+Electronics; ComponentLink2URL: https://datasheet.octopart.com:443/TS-104-T-AA-Samtec-datasheet-150856305.pdf?src-supplier=Electro+Sonic; ComponentLink2Description: https://datasheet.octopart.com:443/TS-104-T-AA-Samtec-datasheet-150856305.pdf?src-supplier=Electro+Sonic; ComponentLink3URL: https://datasheet.octopart.com:443/TS-104-T-AA-Samtec-datasheet-13698575.pdf?src-supplier=Electro+Sonic; ComponentLink3Description: https://datasheet.octopart.com:443/TS-104-T-AA-Samtec-datasheet-13698575.pdf?src-supplier=Electro+Sonic; ComponentLink4URL: https://datasheet.octopart.com:443/TS-104-T-AA-Samtec-datasheet-37173861.pdf?src-supplier=Electro+Sonic; ComponentLink4Description: https://datasheet.octopart.com:443/TS-104-T-AA-Samtec-datasheet-37173861.pdf?src-supplier=Electro+Sonic; ComponentLink5URL: https://datasheet.octopart.com:443/TS-104-T-AA-Samtec-datasheet-41643166.pdf?src-supplier=Farnell; ComponentLink5Description: https://datasheet.octopart.com:443/TS-104-T-AA-Samtec-datasheet-41643166.pdf?src-supplier=Farnell; ComponentLink6URL: https://datasheet.octopart.com:443/TS-104-T-AA-Samtec-datasheet-28904454.pdf?src-supplier=Farnell; ComponentLink6Description: https://datasheet.octopart.com:443/TS-104-T-AA-Samtec-datasheet-28904454.pdf?src-supplier=Farnell; ComponentLink7URL: https://datasheet.octopart.com:443/TS-104-T-AA-Samtec-datasheet-8451641.pdf?src-supplier=Farnell; ComponentLink7Description: https://datasheet.octopart.com:443/TS-104-T-AA-Samtec-datasheet-8451641.pdf?src-supplier=Farnell; ComponentLink8URL: https://datasheet.octopart.com:443/TS-104-T-AA-Samtec-datasheet-179090728.pdf?src-supplier=Sager+Electronics; ComponentLink8Description: https://datasheet.octopart.com:443/TS-104-T-AA-Samtec-datasheet-179090728.pdf?src-supplier=Sager+Electronics; ComponentLink9URL: https://datasheet.octopart.com:443/TS-104-T-AA-Samtec-datasheet-118235246.pdf?src-supplier=Sager+Electronics; ComponentLink9Description: https://datasheet.octopart.com:443/TS-104-T-AA-Samtec-datasheet-118235246.pdf?src-supplier=Sager+Electronics; ComponentLink10URL: https://datasheet.octopart.com:443/TS-104-T-AA-Samtec-datasheet-116533476.pdf?src-supplier=Toby+Electronics; ComponentLink10Description: https://datasheet.octopart.com:443/TS-104-T-AA-Samtec-datasheet-116533476.pdf?src-supplier=Toby+Electronics; ComponentLink11URL: https://datasheet.octopart.com:443/TS-104-T-AA-Samtec-datasheet-116536303.pdf?src-supplier=Toby+Electronics; ComponentLink11Description: https://datasheet.octopart.com:443/TS-104-T-AA-Samtec-datasheet-116536303.pdf?src-supplier=Toby+Electronics; LCSC PN: C6723467
J5 = FTS-102-01-F-S: Connector Header Through Hole 2 position 0.050" (1.27mm); Manufacturer: Samtec; Manufacturer Lifecycle Status: PRODUCTION; Gender: Male; Number of Contacts: 2; Supplier: DigiKey; Manufacturer Part Number: FTS-102-01-F-S; RoHS: Compliant; Category: Headers and Wire Housings; Stock: 861; Pricing: 1=0.49, 50=0.4252, 100=0.3608, 500=0.2994, 1000=0.25609, 2000=0.252 (USD); Contact Plating: Gold; Lifecycle Status: Production; Mounting Technology: Through Hole; Number of Rows: 1; Packaging: Bulk; Pitch: 1.27mm; Radiation Hardening: No; Termination: Solder; ComponentLink1URL: https://datasheet.octopart.com:443/FTS-102-01-F-S-Samtec-datasheet-97029283.pdf?src-supplier=Newark; ComponentLink1Description: https://datasheet.octopart.com:443/FTS-102-01-F-S-Samtec-datasheet-97029283.pdf?src-supplier=Newark; ComponentLink2URL: https://sigma.octopart.com:443/97029285/technical_drawing/Samtec-FTS-102-01-F-S.pdf?src-supplier=Newark; ComponentLink2Description: https://sigma.octopart.com:443/97029285/technical_drawing/Samtec-FTS-102-01-F-S.pdf?src-supplier=Newark; ComponentLink3URL: https://datasheet.octopart.com:443/FTS-102-01-F-S-Samtec-datasheet-118493358.pdf?src-supplier=Electro+Sonic; ComponentLink3Description: https://datasheet.octopart.com:443/FTS-102-01-F-S-Samtec-datasheet-118493358.pdf?src-supplier=Electro+Sonic; ComponentLink4URL: https://datasheet.octopart.com:443/FTS-102-01-F-S-Samtec-datasheet-165596534.pdf?src-supplier=JRH+Electronics; ComponentLink4Description: https://datasheet.octopart.com:443/FTS-102-01-F-S-Samtec-datasheet-165596534.pdf?src-supplier=JRH+Electronics; ComponentLink5URL: https://datasheet.octopart.com:443/FTS-102-01-F-S-Samtec-datasheet-176663378.pdf?src-supplier=Toby+Electronics; ComponentLink5Description: https://datasheet.octopart.com:443/FTS-102-01-F-S-Samtec-datasheet-176663378.pdf?src-supplier=Toby+Electronics; ComponentLink6URL: https://datasheet.octopart.com:443/FTS-102-01-F-S-Samtec-datasheet-116535195.pdf?src-supplier=Toby+Electronics; ComponentLink6Description: https://datasheet.octopart.com:443/FTS-102-01-F-S-Samtec-datasheet-116535195.pdf?src-supplier=Toby+Electronics; ComponentLink7URL: https://datasheet.octopart.com:443/FTS-102-01-F-S-Samtec-datasheet-136395376.pdf?src-supplier=Toby+Electronics; ComponentLink7Description: https://datasheet.octopart.com:443/FTS-102-01-F-S-Samtec-datasheet-136395376.pdf?src-supplier=Toby+Electronics; ComponentLink8URL: https://datasheet.octopart.com:443/FTS-102-01-F-S-Samtec-datasheet-151470456.pdf?src-supplier=Sager+Electronics; ComponentLink8Description: https://datasheet.octopart.com:443/FTS-102-01-F-S-Samtec-datasheet-151470456.pdf?src-supplier=Sager+Electronics; LCSC Part Number: C6045317